# EAGLE design VCF-LM324-Stereo+LFO-Alt (EAGLE 7.2.0)
Voltage-Controlled Low-Pass Filter with LFO using LM324 Quad-Opamp (Stereo) http://electro-music.com/forum/topic-45231-0.html&postdays=0&postorder=asc&highlight=
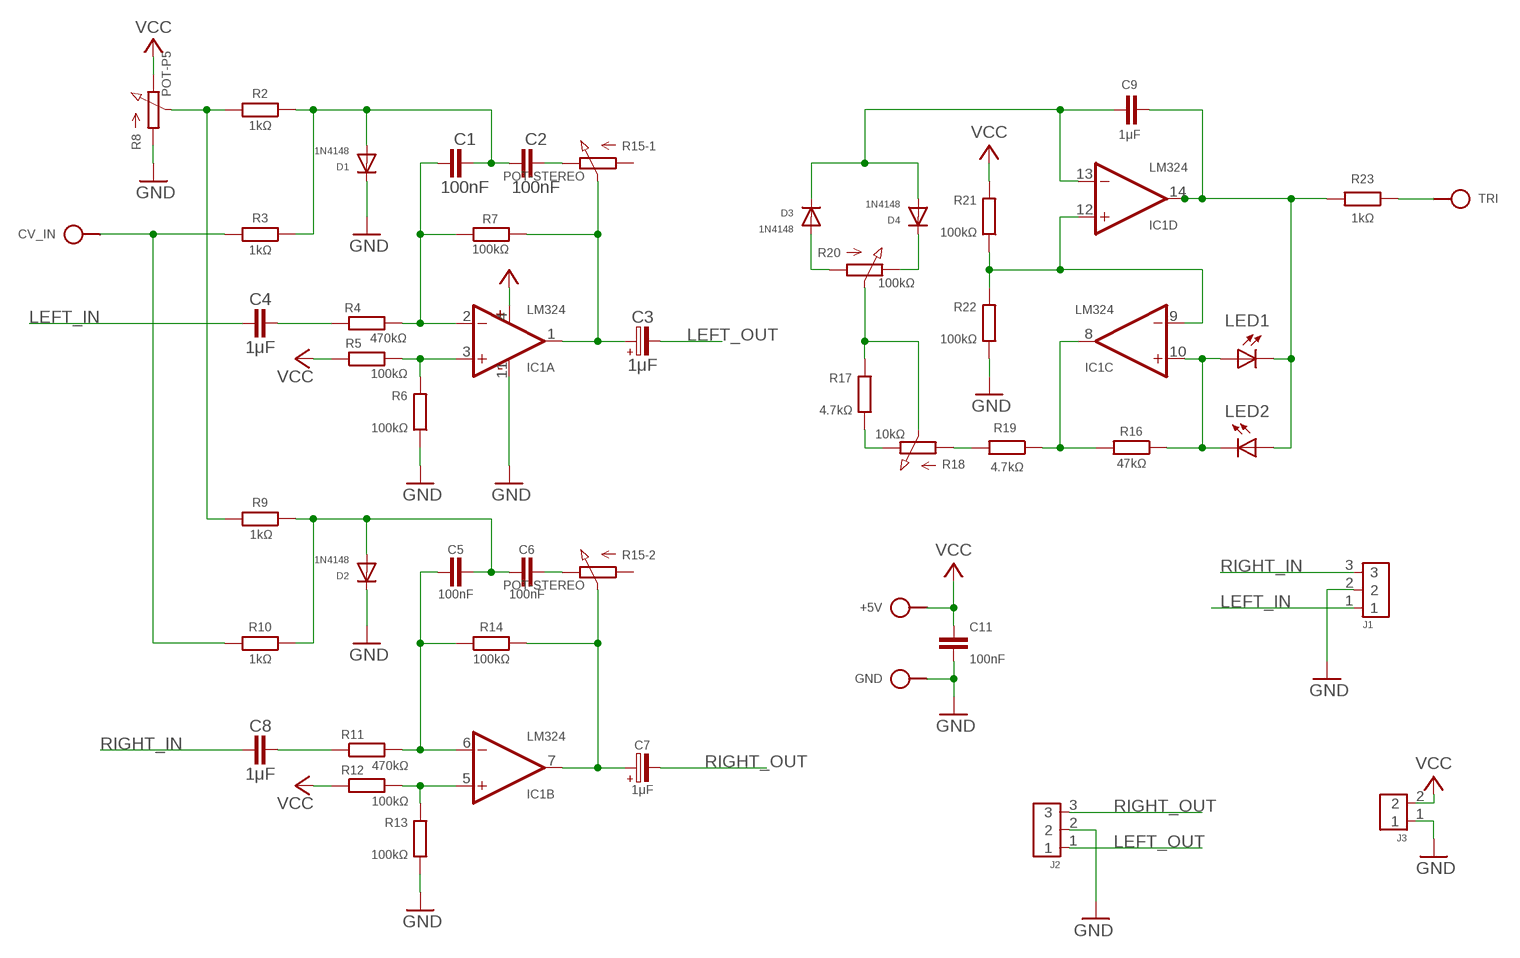
[diagram p0: schematic, sheet 1]

## Parts
+5V  VCC  SPAD  [SPAD]
C1  100nF  C050-024X044  [C050-024X044]
C2  100nF  C050-024X044  [C050-024X044]
C3  1μF  CPOLE2,5-3  [E2,5-3]
C4  1μF  C050-024X044  [C050-024X044]
C5  100nF  C050-024X044  [C050-024X044]
C6  100nF  C050-024X044  [C050-024X044]
C7  1μF  CPOLE2,5-3  [E2,5-3]
C8  1μF  C050-025X075  [C050-025X075]
C9  1μF  C050-024X044/V  [C050-024X044/V]
C11  100nF  C050-024X044  [C050-024X044]
CV_IN  CV_IN  SPAD  [SPAD]
D1  1N4148  1N414834-10V  [DO34-10V]
D2  1N4148  1N414834-7V  [DO34-7V]
D3  1N4148  1N414834-7V  [DO34-7V]
D4  1N4148  1N414834-7V  [DO34-7V]
GND  GND  SPAD  [SPAD]
IC1  LM324  LM324N  [DIL14]
J1  A_IN  CONN-3P-3P  [CONN-3P]
J2  A_OUT  CONN-3P-3P  [CONN-3P]
J3  CONN-2P2P/H  [CONN-2P]
LED1  LED3MM  [LED3MM]
LED2  LED3MM  [LED3MM]
R2  1kΩ  R0204/10  [0204/10]
R3  1kΩ  R0204/10  [0204/10]
R4  470kΩ  R0204/10  [0204/10]
R5  100kΩ  R0204/10  [0204/10]
R6  100kΩ  R0204/10  [0204/10]
R7  100kΩ  R0204/10  [0204/10]
R8  POT-P5  [POT-P5]
R9  1kΩ  R0204/10-V  [0204/10-V]
R10  1kΩ  R0204/10  [0204/10]
R11  470kΩ  R0204/10  [0204/10]
R12  100kΩ  R0204/10  [0204/10]
R13  100kΩ  R0204/10  [0204/10]
R14  100kΩ  R0204/10  [0204/10]
R15  POT-STEREO  [POT-STEREO-2X3]
R16  47kΩ  R0204/10-V  [0204/10-V]
R17  4.7kΩ  R0204/10  [0204/10]
R18  10kΩ  POT  [POT]
R19  4.7kΩ  R0204/10-V  [0204/10-V]
R20  100kΩ  POT  [POT]
R21  100kΩ  R0204/10  [0204/10]
R22  100kΩ  R0204/10  [0204/10]
R23  1kΩ  R0204/10  [0204/10]
TRI  TRIANGLE  SPAD  [SPAD]

## Nets
GND: C11.2 D1.C D2.C GND.1 IC1.11(P:V-) J1.2 J2.2 J3.1 R6.1 R8.A R13.1 R22.1
LEFT_IN: C4.1 J1.1
LEFT_OUT: C3.- J2.1
N$2: C1.1 IC1.2(A:-IN) R4.2 R7.1
N$3: C2.2 R15.1-E(-1:E)
N$4: C3.+ IC1.1(A:OUT) R7.2 R15.1-S(-1:S)
N$5: R2.2 R8.S R9.2
N$7: IC1.3(A:+IN) R5.2 R6.2
N$8: CV_IN.1 R3.2 R10.2
N$9: C1.2 C2.1 D1.A R2.1 R3.1
N$10: C4.2 R4.1
N$11: C6.2 R15.2-E(-2:E)
N$12: C7.+ IC1.7(B:OUT) R14.2 R15.2-S(-2:S)
N$13: IC1.5(B:+IN) R12.2 R13.2
N$14: IC1.8(C:OUT) R16.2 R19.1
N$15: IC1.10(C:+IN) LED1.A LED2.K(C) R16.1
N$16: C5.2 C6.1 D2.A R9.1 R10.1
N$17: C5.1 IC1.6(B:-IN) R11.2 R14.1
N$20: C8.2 R11.1
N$26: C9.1 D3.C D4.A IC1.13(D:-IN)
N$28: C9.2 IC1.14(D:OUT) LED1.K(C) LED2.A R23.2
OA_C_IN+: IC1.9(C:-IN) IC1.12(D:+IN) R21.1 R22.2
RIGHT_IN: C8.1 J1.3
RIGHT_OUT: C7.- J2.3
TRI_OUT: R23.1 TRI.1
TRIM_1_A: D3.A R20.1(A)
TRIM_1_B: D4.C R20.3(E)
TRIM_2_A: R17.1 R18.3(E)
TRIM_2_B: R18.1(A) R19.2
TRIM_P: R17.2 R18.2(S) R20.2(S)
VCC: +5V.1 C11.1 IC1.4(P:V+) J3.2 R5.1 R8.E R12.1 R21.2
Unconnected: R15.1-A(-1:A) R15.2-A(-2:A)

## Library data of the parts
+5V CV_IN GND TRI = pad:SPAD
C1 C2 C4-C6 C8 C9 C11 = c:C: CAPACITOR, European symbol
C3 C7 = c:CPOL: POLARIZED CAPACITOR, European symbol
D1-D4 = d:1N4148
IC1 = ic:LM324: OP AMP
J1 J2 = pinconn:CONN-3P
J3 = pinconn:CONN-2P
LED1 LED2 = led:LED: LED OSRAM: - CHIPLED LG R971, LG N971, LY N971, LG Q971, LY Q971, LO R971, LY R971 LH N974, LH R974 LS Q976, LO Q976, LY Q976 LO Q996 - Hyper CHIPLED LW Q18S LB Q993, LB Q99A, LB R99A - SideLED LS A670, LO A670, LY A670, LG A670, LP A670 LB A673, LV A673, LT A673, LW A673 LH A674 LY A675 LS A676, LA A676, LO A676, LY A676, LW A676 LS A679, LY A679, LG A679 - Hyper Micro SIDELED@@ LS Y876, LA Y876, LO Y876, LY Y876 LT Y87S - SmartLED LW L88C, LW L88S LB L89C, LB L89S, LG L890 LS L89K, LO L89K, LY L89K LS L896, LA L896, LO L896, LY L896 - TOPLED LS T670, LO T670, LY T670, LG T670, LP T670 LSG T670, LSP T670, LSY T670, LOP T670, LYG T670 LG T671, LOG T671, LSG T671 LB T673, LV T673, LT T673, LW T673 LH T674 LS T676, LA T676, LO T676, LY T676, LB T676, LH T676, LSB T676, LW T676 LB T67C, LV T67C, LT T67C, LS T67K, LO T67K, LY T67K, LW E67C LS E67B, LA E67B, LO E67B, LY E67B, LB E67C, LV E67C, LT E67C LW T67C LS T679, LY T679, LG T679 LS T770, LO T770, LY T770, LG T770, LP T770 LB T773, LV T773, LT T773, LW T773 LH T774 LS E675, LA E675, LY E675, LS T675 LS T776, LA T776, LO T776, LY T776, LB T776 LHGB T686 LT T68C, LB T68C - Hyper Mini TOPLED@@ LB M676 - Mini TOPLED Santana@@ LG M470 LS M47K, LO M47K, LY M47K Source: http://www.osram.convergy.de LUXEON: - LUMILED@@ LXK2-PW12-R00, LXK2-PW12-S00, LXK2-PW14-U00, LXK2-PW14-V00 LXK2-PM12-R00, LXK2-PM12-S00, LXK2-PM14-U00 LXK2-PE12-Q00, LXK2-PE12-R00, LXK2-PE12-S00, LXK2-PE14-T00, LXK2-PE14-U00 LXK2-PB12-K00, LXK2-PB12-L00, LXK2-PB12-M00, LXK2-PB14-N00, LXK2-PB14-P00, LXK2-PB14-Q00 LXK2-PR12-L00, LXK2-PR12-M00, LXK2-PR14-Q00, LXK2-PR14-R00 LXK2-PD12-Q00, LXK2-PD12-R00, LXK2-PD12-S00 LXK2-PH12-R00, LXK2-PH12-S00 LXK2-PL12-P00, LXK2-PL12-Q00, LXK2-PL12-R00 Source: www.luxeon.com KINGBRIGHT: KA-3528ASYC Source: www.kingbright.com
R2-R7 R9-R14 R16 R17 R19 R21-R23 = r:R: RESISTOR, European symbol
R8 R18 R20 = r:POT
R15 = r:POT-STEREO

## Module LFO
Ports: TRI_OUT(io) GND(io) VCC(io)
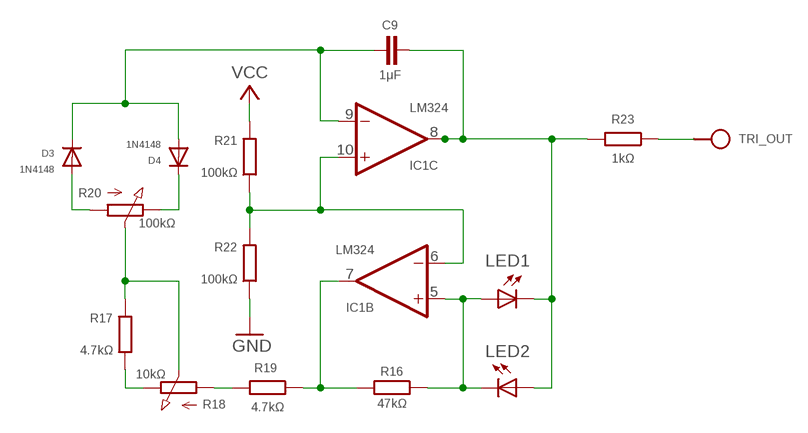
[diagram p1: schematic, module LFO, sheet 1]

### Parts
C9  1μF  C050-024X044/V  [C050-024X044/V]
D3  1N4148  1N414834-7V  [DO34-7V]
D4  1N4148  1N414834-7V  [DO34-7V]
IC1  LM324  LM324N  [DIL14]
LED1  LED3MM  [LED3MM]
LED2  LED3MM  [LED3MM]
R16  47kΩ  R0202/7-V  [0202/7-V]
R17  4.7kΩ  R0202/7  [0202/7]
R18  10kΩ  POT  [POT]
R19  4.7kΩ  R0202/7-V  [0202/7-V]
R20  100kΩ  POT  [POT]
R21  100kΩ  R0202/7-V  [0202/7-V]
R22  100kΩ  R0202/7-V  [0202/7-V]
R23  1kΩ  R0202/7-V  [0202/7-V]
TRI_OUT  TRIANGLE  SPAD  [SPAD]

### Nets
GND: R22.1
N$14: IC1.7(B:OUT) R16.2 R19.1
N$15: IC1.5(B:+IN) LED1.A LED2.K(C) R16.1
N$26: C9.1 D3.C D4.A IC1.9(C:-IN)
N$28: C9.2 IC1.8(C:OUT) LED1.K(C) LED2.A R23.2
OA_C_IN+: IC1.6(B:-IN) IC1.10(C:+IN) R21.1 R22.2
TRI_OUT: R23.1 TRI_OUT.1
TRIM_1_A: D3.A R20.1(A)
TRIM_1_B: D4.C R20.3(E)
TRIM_2_A: R17.1 R18.3(E)
TRIM_2_B: R18.1(A) R19.2
TRIM_P: R17.2 R18.2(S) R20.2(S)
VCC: R21.2
Unconnected: IC1.1(A:OUT) IC1.2(A:-IN) IC1.3(A:+IN) IC1.12(D:+IN) IC1.13(D:-IN) IC1.14(D:OUT)

### Power pins joined to a net without a drawn wire
V+: IC1.4(P:V+)
V-: IC1.11(P:V-)

### Library data of the parts
C9 = c:C: CAPACITOR, European symbol
D3 D4 = d:1N4148
IC1 = ic:LM324: OP AMP
LED1 LED2 = led:LED: LED OSRAM: - CHIPLED LG R971, LG N971, LY N971, LG Q971, LY Q971, LO R971, LY R971 LH N974, LH R974 LS Q976, LO Q976, LY Q976 LO Q996 - Hyper CHIPLED LW Q18S LB Q993, LB Q99A, LB R99A - SideLED LS A670, LO A670, LY A670, LG A670, LP A670 LB A673, LV A673, LT A673, LW A673 LH A674 LY A675 LS A676, LA A676, LO A676, LY A676, LW A676 LS A679, LY A679, LG A679 - Hyper Micro SIDELED@@ LS Y876, LA Y876, LO Y876, LY Y876 LT Y87S - SmartLED LW L88C, LW L88S LB L89C, LB L89S, LG L890 LS L89K, LO L89K, LY L89K LS L896, LA L896, LO L896, LY L896 - TOPLED LS T670, LO T670, LY T670, LG T670, LP T670 LSG T670, LSP T670, LSY T670, LOP T670, LYG T670 LG T671, LOG T671, LSG T671 LB T673, LV T673, LT T673, LW T673 LH T674 LS T676, LA T676, LO T676, LY T676, LB T676, LH T676, LSB T676, LW T676 LB T67C, LV T67C, LT T67C, LS T67K, LO T67K, LY T67K, LW E67C LS E67B, LA E67B, LO E67B, LY E67B, LB E67C, LV E67C, LT E67C LW T67C LS T679, LY T679, LG T679 LS T770, LO T770, LY T770, LG T770, LP T770 LB T773, LV T773, LT T773, LW T773 LH T774 LS E675, LA E675, LY E675, LS T675 LS T776, LA T776, LO T776, LY T776, LB T776 LHGB T686 LT T68C, LB T68C - Hyper Mini TOPLED@@ LB M676 - Mini TOPLED Santana@@ LG M470 LS M47K, LO M47K, LY M47K Source: http://www.osram.convergy.de LUXEON: - LUMILED@@ LXK2-PW12-R00, LXK2-PW12-S00, LXK2-PW14-U00, LXK2-PW14-V00 LXK2-PM12-R00, LXK2-PM12-S00, LXK2-PM14-U00 LXK2-PE12-Q00, LXK2-PE12-R00, LXK2-PE12-S00, LXK2-PE14-T00, LXK2-PE14-U00 LXK2-PB12-K00, LXK2-PB12-L00, LXK2-PB12-M00, LXK2-PB14-N00, LXK2-PB14-P00, LXK2-PB14-Q00 LXK2-PR12-L00, LXK2-PR12-M00, LXK2-PR14-Q00, LXK2-PR14-R00 LXK2-PD12-Q00, LXK2-PD12-R00, LXK2-PD12-S00 LXK2-PH12-R00, LXK2-PH12-S00 LXK2-PL12-P00, LXK2-PL12-Q00, LXK2-PL12-R00 Source: www.luxeon.com KINGBRIGHT: KA-3528ASYC Source: www.kingbright.com
R16 R17 R19 R21-R23 = r:R: RESISTOR, European symbol
R18 R20 = r:POT
TRI_OUT = pad:SPAD

## Module VCF-L
Ports: 

### Library data of the parts

## Net classes
0 default: width 0.61 mm

## Board
Voltage-Controlled Low-Pass Filter with LFO using LM324 Quad-Opamp (Stereo) http://electro-music.com/forum/topic-45231-0.html&postdays=0&postorder=asc&highlight=
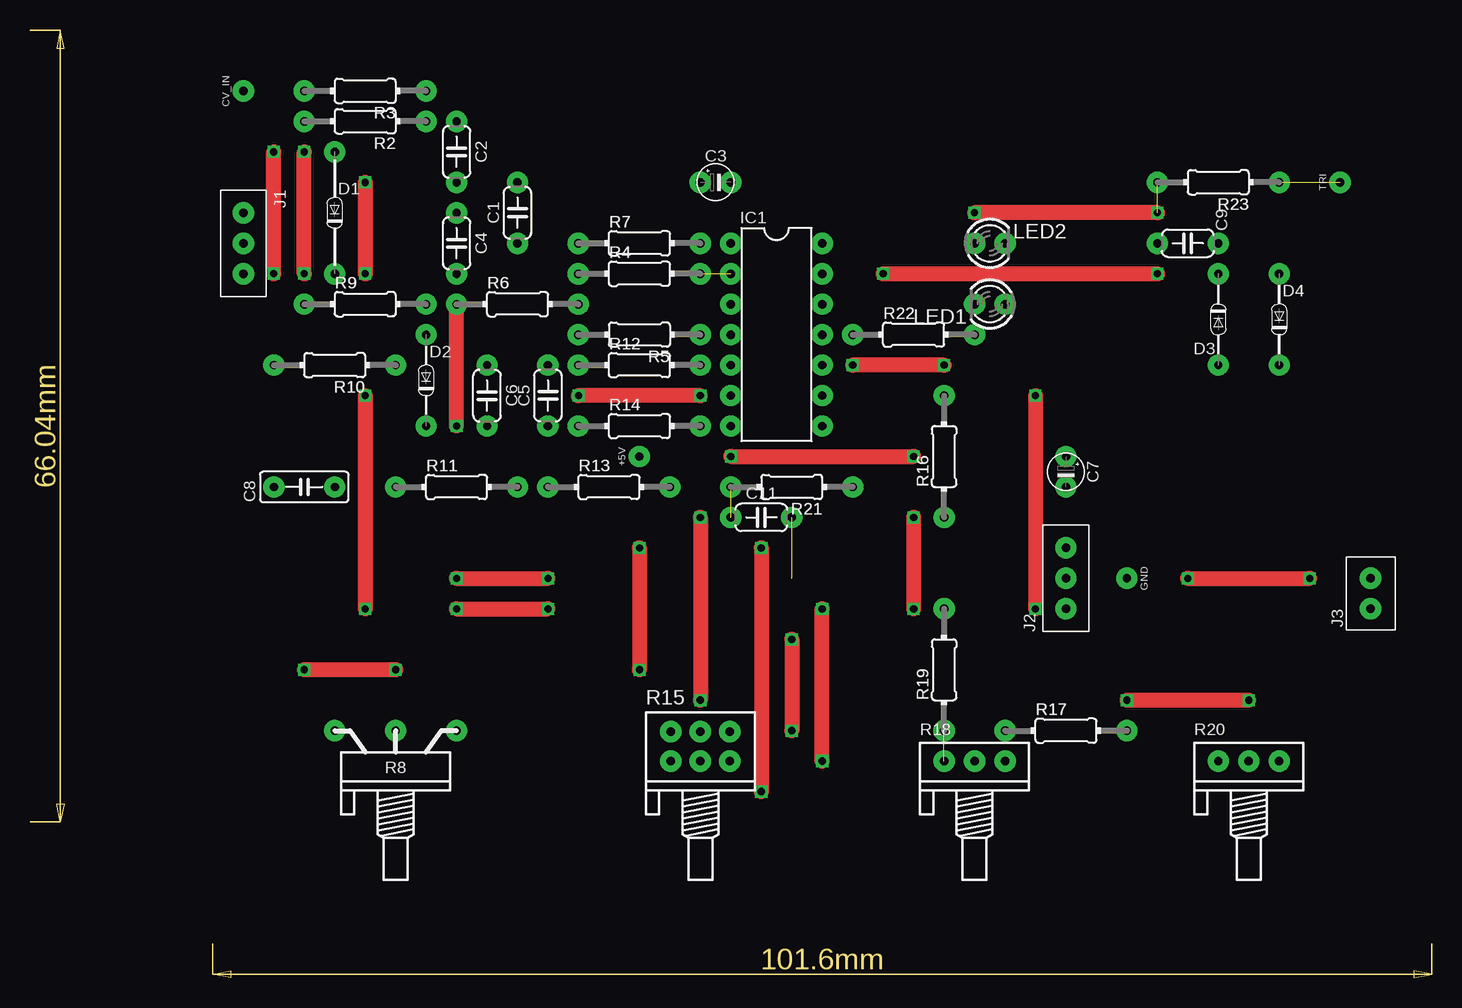
[diagram p2: board, top side]
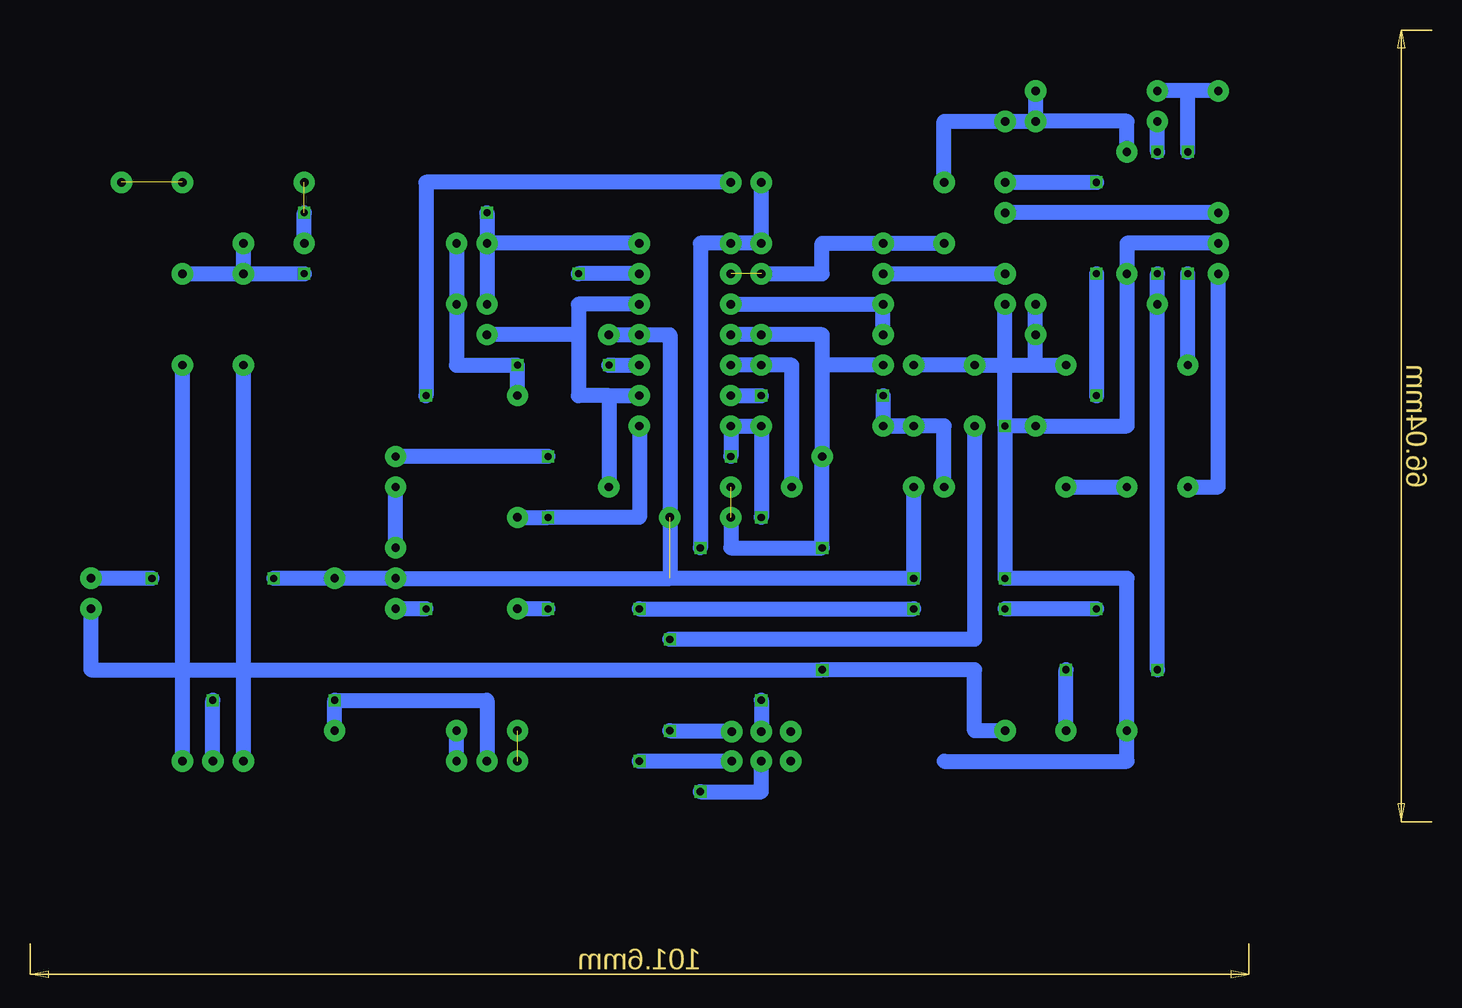
[diagram p3: board, bottom side, seen from below]

Size 116.84 x 79.04 mm. Coordinates in mm from the lower left corner, seen from the top.
Copper layers (1*16): Top 0.035mm / dielectric 1.5mm / Bottom 0.035mm
Design rules "default": minimum track width 10mil, minimum drill 24mil, track to track 8mil, track to pad 8mil, pad to pad 8mil, via to via 8mil, smd to smd 8mil, copper to edge 40mil, drill to drill 8mil, minimum pad ring 10mil, minimum via ring 8mil, stop-mask expansion 4mil, vias tented up to drill 0mil, thermal gap 10mil

### Footprints (pad centres in the part's own frame; a part is rotated, then mirrored left to right if it is on the bottom)
SPAD = drill 0.7 pad 1.778: 1 0,0
C050-024X044 = drill 0.7 pad 1.778: 1 -2.54,0; 2 2.54,0
E2,5-3 = drill 0.7 pad 1.778: + 0,1.27; - 0,-1.27
C050-025X075 = drill 0.7 pad 1.778: 1 2.54,0; 2 -2.54,0
C050-024X044/V = drill 0.7 pad 1.778: 1 0,2.54; 2 0,-2.54
DO34-10V = drill 0.7 pad 1.778: A 0,5.08; C 0,-5.08
DO34-7V = drill 0.7 pad 1.778: A 0,3.81; C 0,-3.81
DIL14 = drill 0.7 pad 1.778: 1 -3.81,7.62; 2 -3.81,5.08; 3 -3.81,2.54; 4 -3.81,0; 5 -3.81,-2.54; 6 -3.81,-5.08; 7 -3.81,-7.62; 8 3.81,-7.62; 9 3.81,-5.08; 10 3.81,-2.54; 11 3.81,0; 12 3.81,2.54; 13 3.81,5.08; 14 3.81,7.62
CONN-3P = drill 0.7 pad 1.778: 1 0,0; 2 2.54,0; 3 5.08,0
CONN-2P = drill 0.7 pad 1.778: 1 0,0; 2 -2.54,0
LED3MM = drill 0.7 pad 1.778: A -1.27,0; K 1.27,0
0204/10 = drill 0.7 pad 1.778: 1 -5.08,0; 2 5.08,0
POT-P5 = drill 0.7 pad 1.778: A -5.08,2.54; E 5.08,2.54; S 0,2.54
0204/10-V = drill 0.7 pad 1.778: 1 0,5.08; 2 0,-5.08
POT-STEREO-2X3 = drill 0.7 pad 1.778: 1-A -2.46,-2.54; 1-E 2.46,-2.54; 1-S 0,-2.54; 2-A -2.46,-0.08; 2-E 2.46,-0.08; 2-S 0,-0.08
POT = drill 0.7 pad 1.778: 1 -2.54,0; 2 0,0; 3 2.54,0

### Placement (x,y rotation side)
+5V  50.8,43.48 0 top
C1  40.64,63.8 90 top
C2  35.56,68.88 270 top
C3  1uF  [E2,5-3]  57.15,66.34 90 top
C4  1uF  [C050-024X044]  35.56,61.26 270 top
C5  43.18,48.56 90 top
C6  38.1,48.56 270 top
C7  1uF  [E2,5-3]  86.36,42.21 0 top
C8  1uF  [C050-025X075]  22.86,40.94 180 top
C9  1uF  [C050-024X044/V]  96.52,61.26 270 top
C11  60.96,38.4 0 top
CV_IN  17.78,73.96 0 top
D1  25.4,63.8 0 top
D2  33.02,49.83 0 top
D3  99.06,54.91 180 top
D4  104.14,54.91 0 top
GND  91.44,33.32 180 top
IC1  62.23,53.64 0 top
J1  17.78,63.8 270 top
J2  86.36,30.78 90 top
J3  111.76,33.32 90 top
LED1  80.01,56.18 180 top
LED2  80.01,61.26 0 top
R2  1k  [0204/10]  27.94,71.42 180 top
R3  1k  [0204/10]  27.94,73.96 180 top
R4  470k  [0204/10]  50.8,58.72 0 top
R5  100k  [0204/10]  50.8,53.64 180 top
R6  100k  [0204/10]  40.64,56.18 0 top
R7  100k  [0204/10]  50.8,61.26 0 top
R8  30.48,18.08 0 top
R9  1k  [0204/10-V]  27.94,56.18 270 top
R10  1k  [0204/10]  25.4,51.1 180 top
R11  470k  [0204/10]  35.56,40.94 0 top
R12  100k  [0204/10]  50.8,51.1 0 top
R13  100k  [0204/10]  48.26,40.94 0 top
R14  100k  [0204/10]  50.8,46.02 0 top
R15  55.88,20.62 0 top
R16  47k  [0204/10-V]  76.2,43.48 0 top
R17  4.7k  [0204/10]  86.36,20.62 0 top
R18  10k  [POT]  78.74,18.08 0 top
R19  4.7k  [0204/10-V]  76.2,25.7 0 top
R20  100k  [POT]  101.6,18.08 0 top
R21  100k  [0204/10]  63.5,40.94 180 top
R22  100k  [0204/10]  73.66,53.64 0 top
R23  1k  [0204/10]  99.06,66.34 180 top
TRI  109.22,66.34 0 top

### Tracks (layer width: path | path; a pad name or v marks a point on that pad's centre or on a via)
GND  (via drill 0.6)  (1 unrouted)
  Top 1.27: v35.56,46.02 R6.1 | v35.56,33.32 v43.18,33.32 | v96.52,33.32 v106.68,33.32
  Bottom 1.27: 63.5,33.32 63.5,53.64 IC1.11 R22.1 | 63.5,33.32 J2.2 GND.1 v96.52,33.32 | J1.2 25.4,61.26 D1.C 25.4,46.02 D2.C v35.56,46.02 | v35.56,46.02 v35.56,33.32 25.4,33.32 R8.A 25.4,18.08 40.64,18.08 | v35.56,46.02 R6.1 | R13.1 v43.18,33.32 63.5,33.32 | v106.68,33.32 J3.1
  other vias: 35.56,56.18 25.4,58.72 25.4,58.72
LEFT_IN
  Bottom 1.27: J1.1 C4.1
LEFT_OUT  (via drill 0.6)
  Top 1.27: v83.82,48.56 v83.82,30.78
  Bottom 1.27: C3.- 83.82,66.34 v83.82,48.56 | v83.82,30.78 J2.1
N$2  (1 unrouted)
  Bottom 1.27: R4.2 50.8,58.72 50.8,61.26 R7.1 C1.1
N$3  (via drill 0.6)
  Top 1.27: v66.04,18.08 v66.04,30.78 | v27.94,66.34 v27.94,58.72 | v27.94,48.56 v27.94,30.78 | v35.56,30.78 v43.18,30.78
  Bottom 1.27: 58.42,18.08 v66.04,18.08 | v66.04,30.78 v43.18,30.78 | C2.2 v27.94,66.34 | v27.94,58.72 v27.94,48.56 | v27.94,30.78 v35.56,30.78
N$4  (via drill 0.6)
  Top 1.27: v60.96,35.86 v60.96,15.54
  Bottom 1.27: R7.2 IC1.1 | R7.2 C3.+ | R7.2 60.96,61.26 v60.96,35.86 | v60.96,15.54 55.88,15.54 R15.1-S
N$5  (via drill 0.6)
  Top 1.27: v30.48,25.7 v22.86,25.7 | v22.86,58.72 v22.86,68.88
  Bottom 1.27: R8.S v30.48,25.7 | v22.86,25.7 R9.2 v22.86,58.72 | v22.86,68.88 R2.2
N$7
  Bottom 1.27: IC1.3 R6.2 R5.2
N$8  (via drill 0.6)
  Top 1.27: v20.32,58.72 v20.32,68.88
  Bottom 1.27: R10.2 v20.32,58.72 | v20.32,68.88 20.32,73.96 R3.2 CV_IN.1
N$9
  Bottom 1.27: C1.2 40.64,71.42 R2.1 | C2.1 R2.1 | D1.A 25.4,71.42 R2.1 | R3.1 R2.1
N$10
  Bottom 1.27: R4.1 C4.2
N$11  (via drill 0.6)
  Top 1.27: v63.5,28.24 v63.5,20.62
  Bottom 1.27: C6.2 38.1,28.24 v63.5,28.24 | v63.5,20.62 58.42,20.62 | 58.42,20.62
N$12  (via drill 0.6)
  Top 1.27: v55.88,38.4 v55.88,23.16 | v58.42,43.48 v73.66,43.48
  Bottom 1.27: v55.88,38.4 R14.2 IC1.7 v58.42,43.48 | v55.88,23.16 55.88,20.62 | v73.66,43.48 C7.+
N$13
  Bottom 1.27: R13.2 53.34,51.1 R12.2 IC1.5
N$14  (via drill 0.6)
  Top 1.27: v73.66,38.4 v73.66,30.78
  Bottom 1.27: IC1.8 66.04,38.4 v73.66,38.4 R16.2 | v73.66,30.78 R19.1
N$15  (via drill 0.6)
  Top 1.27: v76.2,51.1 v68.58,51.1
  Bottom 1.27: LED2.K LED1.A 81.28,51.1 v76.2,51.1 R16.1 | v68.58,51.1 IC1.10
N$16
  Bottom 1.27: 33.02,51.1 R10.1 | R9.1 D2.A 33.02,51.1 | 33.02,51.1 C6.1 C5.2
N$17  (via drill 0.6)
  Top 1.27: v55.88,48.56 v45.72,48.56
  Bottom 1.27: IC1.6 v55.88,48.56 | v45.72,48.56 R14.1 | R14.1 C5.1 | R11.2 40.64,46.02 R14.1
N$20
  Bottom 1.27: R11.1 C8.2
N$26  (via drill 0.6)
  Top 1.27: v71.12,58.72 v93.98,58.72
  Bottom 1.27: IC1.13 v71.12,58.72 | D4.A D3.C | C9.1 D3.C | D3.C v93.98,58.72
N$28  (via drill 0.6)  (1 unrouted)
  Top 1.27: v93.98,63.8 v78.74,63.8
  Bottom 1.27: IC1.14 LED2.A | LED2.A LED1.K | C9.2 v93.98,63.8 | v78.74,63.8 LED2.A
OA_C_IN+
  Bottom 1.27: IC1.12 71.12,56.18 71.12,53.64 | 71.12,53.64 71.12,48.56 68.58,48.56 | 68.58,48.56 IC1.9 | 68.58,48.56 R21.1 | 71.12,53.64 R22.2
RIGHT_IN
  Bottom 1.27: C8.1 17.78,40.94 J1.3
RIGHT_OUT
  Bottom 1.27: J2.3 C7.-
TRI_OUT  (1 unrouted)
TRIM_1_A
  Bottom 1.27: D3.A R20.1
TRIM_1_B
  Bottom 1.27: D4.C R20.3
TRIM_2_A
  Bottom 1.27: R18.3 R17.1
TRIM_2_B  (1 unrouted)
TRIM_P  (via drill 0.6)
  Top 1.27: v101.6,23.16 v91.44,23.16
  Bottom 1.27: R20.2 v101.6,23.16 | R18.2 78.74,23.16 v91.44,23.16 R17.2
VCC  (via drill 0.6)  (1 unrouted)
  Top 1.27: v50.8,35.86 v50.8,25.7
  Bottom 1.27: 50.8,51.1 50.8,53.64 R5.1 IC1.4 | 50.8,51.1 +5V.1 v50.8,35.86 58.42,35.86 C11.1 | R8.E 38.1,20.62 38.1,25.7 v50.8,25.7 111.76,25.7 J3.2 | R12.1 50.8,51.1